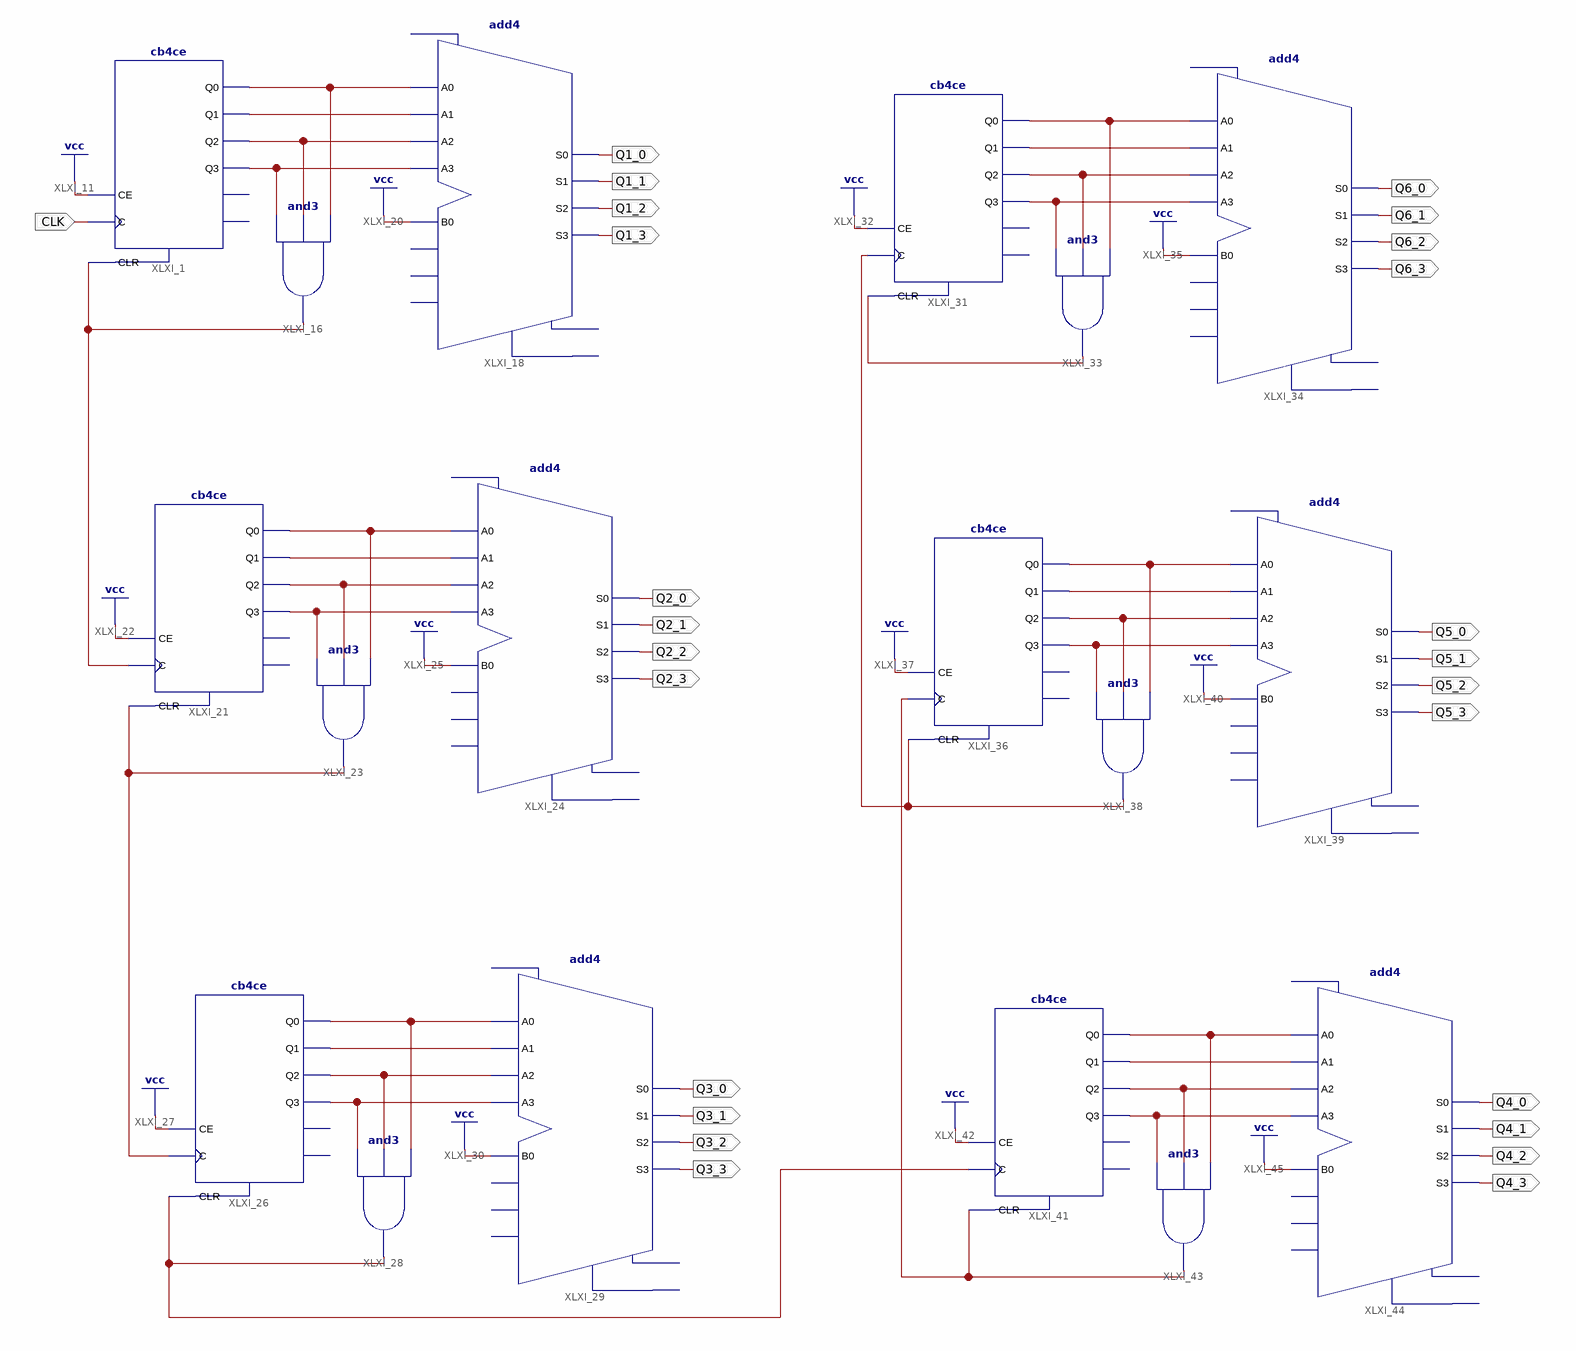
[diagram p0: schematic sheet 1]
// Xilinx ISE schematic initRandom.sch (spartan3) as structural Verilog: 18 symbols, 25 ports
module initRandom (
  input  CLK,
  output Q1_0,
  output Q1_1,
  output Q1_2,
  output Q1_3,
  output Q2_0,
  output Q2_1,
  output Q2_2,
  output Q2_3,
  output Q3_0,
  output Q3_1,
  output Q3_2,
  output Q3_3,
  output Q6_0,
  output Q6_1,
  output Q6_2,
  output Q6_3,
  output Q5_0,
  output Q5_1,
  output Q5_2,
  output Q5_3,
  output Q4_0,
  output Q4_1,
  output Q4_2,
  output Q4_3
);

  wire XLXN_2, XLXN_13, XLXN_14, XLXN_30, XLXN_31, XLXN_37, XLXN_38, XLXN_39, XLXN_40, XLXN_41, XLXN_49,
       XLXN_50, XLXN_51, XLXN_52, XLXN_53, XLXN_61, XLXN_62, XLXN_63, XLXN_64, XLXN_65, XLXN_73, XLXN_74,
       XLXN_75, XLXN_77, XLXN_85, XLXN_86, XLXN_87, XLXN_89, XLXN_98, XLXN_99;

  cb4ce XLXI_1 (
    .C(CLK), .CE(1'b1), .CLR(XLXN_30), .Q0(XLXN_2), .Q1(XLXN_31), .Q2(XLXN_13), .Q3(XLXN_14));  // open: CEO, TC
  and XLXI_16 (XLXN_30, XLXN_14, XLXN_13, XLXN_2);
  add4 XLXI_18 (
    .A0(XLXN_2), .A1(XLXN_31), .A2(XLXN_13), .A3(XLXN_14), .B0(1'b1), .S0(Q1_0), .S1(Q1_1), .S2(Q1_2),
    .S3(Q1_3));  // open: B1, B2, B3, CI, CO, OFL
  cb4ce XLXI_21 (
    .C(XLXN_30), .CE(1'b1), .CLR(XLXN_40), .Q0(XLXN_37), .Q1(XLXN_41), .Q2(XLXN_38), .Q3(XLXN_39));  // open: CEO, TC
  and XLXI_23 (XLXN_40, XLXN_39, XLXN_38, XLXN_37);
  add4 XLXI_24 (
    .A0(XLXN_37), .A1(XLXN_41), .A2(XLXN_38), .A3(XLXN_39), .B0(1'b1), .S0(Q2_0), .S1(Q2_1), .S2(Q2_2),
    .S3(Q2_3));  // open: B1, B2, B3, CI, CO, OFL
  cb4ce XLXI_26 (
    .C(XLXN_40), .CE(1'b1), .CLR(XLXN_52), .Q0(XLXN_49), .Q1(XLXN_53), .Q2(XLXN_50), .Q3(XLXN_51));  // open: CEO, TC
  and XLXI_28 (XLXN_52, XLXN_51, XLXN_50, XLXN_49);
  add4 XLXI_29 (
    .A0(XLXN_49), .A1(XLXN_53), .A2(XLXN_50), .A3(XLXN_51), .B0(1'b1), .S0(Q3_0), .S1(Q3_1), .S2(Q3_2),
    .S3(Q3_3));  // open: B1, B2, B3, CI, CO, OFL
  cb4ce XLXI_31 (
    .C(XLXN_99), .CE(1'b1), .CLR(XLXN_64), .Q0(XLXN_61), .Q1(XLXN_65), .Q2(XLXN_62), .Q3(XLXN_63));  // open: CEO, TC
  and XLXI_33 (XLXN_64, XLXN_63, XLXN_62, XLXN_61);
  add4 XLXI_34 (
    .A0(XLXN_61), .A1(XLXN_65), .A2(XLXN_62), .A3(XLXN_63), .B0(1'b1), .S0(Q6_0), .S1(Q6_1), .S2(Q6_2),
    .S3(Q6_3));  // open: B1, B2, B3, CI, CO, OFL
  cb4ce XLXI_36 (
    .C(XLXN_98), .CE(1'b1), .CLR(XLXN_99), .Q0(XLXN_73), .Q1(XLXN_77), .Q2(XLXN_74), .Q3(XLXN_75));  // open: CEO, TC
  and XLXI_38 (XLXN_99, XLXN_75, XLXN_74, XLXN_73);
  add4 XLXI_39 (
    .A0(XLXN_73), .A1(XLXN_77), .A2(XLXN_74), .A3(XLXN_75), .B0(1'b1), .S0(Q5_0), .S1(Q5_1), .S2(Q5_2),
    .S3(Q5_3));  // open: B1, B2, B3, CI, CO, OFL
  cb4ce XLXI_41 (
    .C(XLXN_52), .CE(1'b1), .CLR(XLXN_98), .Q0(XLXN_85), .Q1(XLXN_89), .Q2(XLXN_86), .Q3(XLXN_87));  // open: CEO, TC
  and XLXI_43 (XLXN_98, XLXN_87, XLXN_86, XLXN_85);
  add4 XLXI_44 (
    .A0(XLXN_85), .A1(XLXN_89), .A2(XLXN_86), .A3(XLXN_87), .B0(1'b1), .S0(Q4_0), .S1(Q4_1), .S2(Q4_2),
    .S3(Q4_3));  // open: B1, B2, B3, CI, CO, OFL
endmodule
